# EAGLE design vga_board (EAGLE 7.7.0)
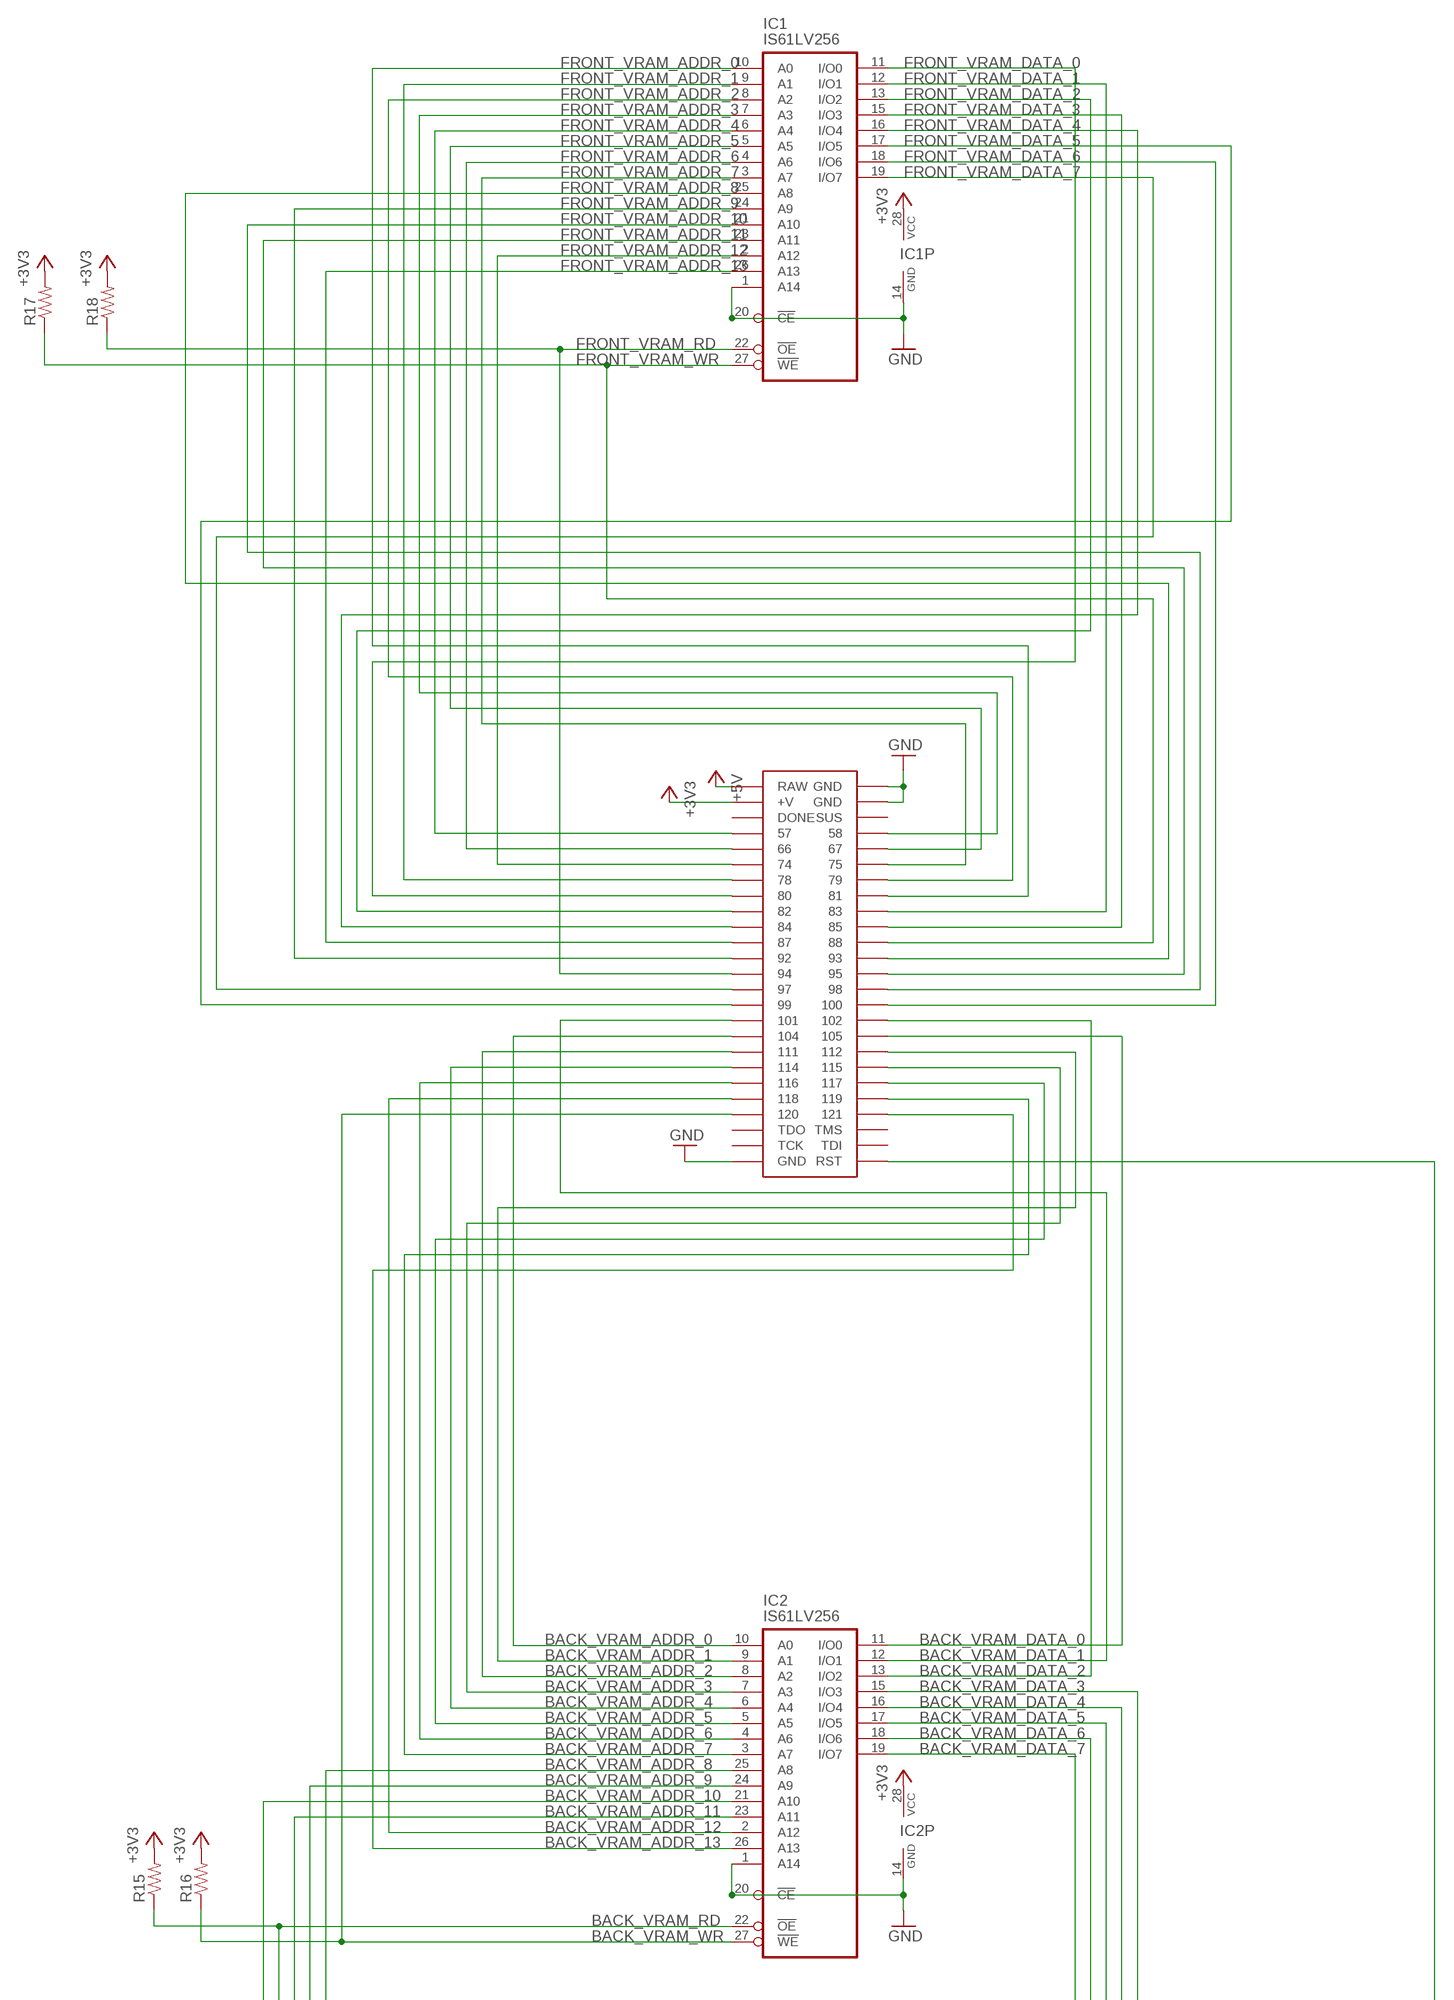
[diagram p0: schematic, sheet 1, part 1 of 2]
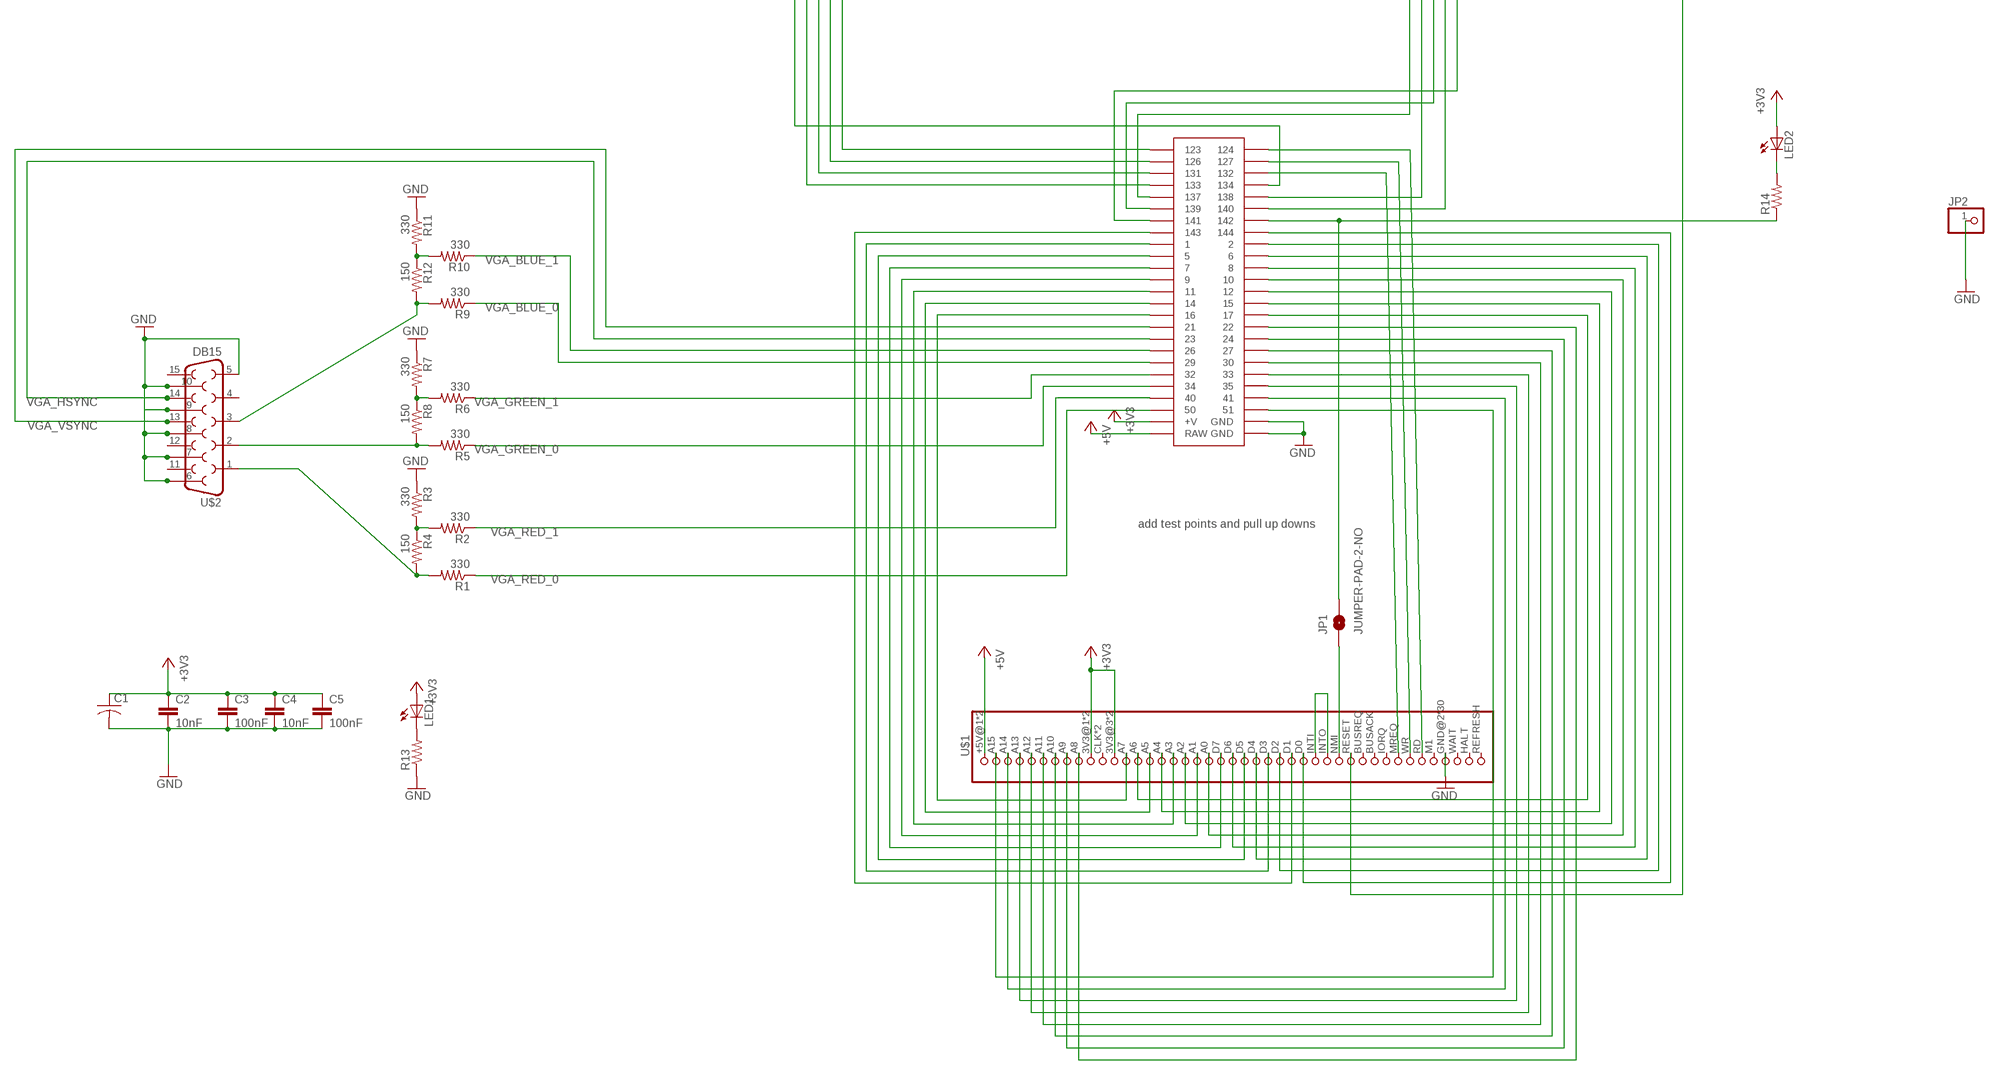
[diagram p1: schematic, sheet 1, part 2 of 2]

## Parts
C1  C-USC1210  [C1210]
C2  10nF  22UF-6.3V-20%(0805)  [0805]
C3  100nF  22UF-6.3V-20%(0805)  [0805]
C4  10nF  22UF-6.3V-20%(0805)  [0805]
C5  100nF  22UF-6.3V-20%(0805)  [0805]
IC1  IS61LV256  [SOJ28/3_LONGPAD]
IC2  IS61LV256  [SOJ28/3_LONGPAD]
JP1  JUMPER-PAD-2-NO  [PAD-JUMPER-2-NO_NO_SILK]
JP2  PINHD-1X1  [1X01]
LED1  LEDCHIP-LED0805  [CHIP-LED0805]
LED2  LEDCHIP-LED0805  [CHIP-LED0805]
R1  330  RESISTOR0805-RES  [0805]
R2  330  RESISTOR0805-RES  [0805]
R3  330  RESISTOR0805-RES  [0805]
R4  150  RESISTOR0805-RES  [0805]
R5  330  RESISTOR0805-RES  [0805]
R6  330  RESISTOR0805-RES  [0805]
R7  330  RESISTOR0805-RES  [0805]
R8  150  RESISTOR0805-RES  [0805]
R9  330  RESISTOR0805-RES  [0805]
R10  330  RESISTOR0805-RES  [0805]
R11  330  RESISTOR0805-RES  [0805]
R12  150  RESISTOR0805-RES  [0805]
R13  RESISTOR0805-RES  [0805]
R14  RESISTOR0805-RES  [0805]
R15  RESISTOR0805-RES  [0805]
R16  RESISTOR0805-RES  [0805]
R17  RESISTOR0805-RES  [0805]
R18  RESISTOR0805-RES  [0805]
U$1  FAP_BUS  [2X38]
U$2  DB15  [DB15]
U$3  MOJOV3_NO_LABEL  [MOJO_V3_NO_LABEL]

## Nets
+3V3: C1.1 C2.1 C3.1 C4.1 C5.1 IC1.28(VCC) IC2.28(VCC) LED1.A LED2.A R15.2 R16.2 R17.2 R18.2 U$1.3V3@1 U$1.3V3@2 U$1.3V3@3 U$1.3V3@4 U$3.V@1(+V)
+5V: U$1.+5V@1 U$1.+5V@2 U$3.RAW@1(RAW)
+V: U$3.V@2(+V) ; supply symbol labelled +3V3
BACK_VRAM_ADDR_0: IC2.10(A0) U$3.104
BACK_VRAM_ADDR_1: IC2.9(A1) U$3.112
BACK_VRAM_ADDR_2: IC2.8(A2) U$3.111
BACK_VRAM_ADDR_3: IC2.7(A3) U$3.115
BACK_VRAM_ADDR_4: IC2.6(A4) U$3.114
BACK_VRAM_ADDR_5: IC2.5(A5) U$3.117
BACK_VRAM_ADDR_6: IC2.4(A6) U$3.116
BACK_VRAM_ADDR_7: IC2.3(A7) U$3.119
BACK_VRAM_ADDR_8: IC2.25(A8) U$3.123
BACK_VRAM_ADDR_9: IC2.24(A9) U$3.126
BACK_VRAM_ADDR_10: IC2.21(A10) U$3.134
BACK_VRAM_ADDR_11: IC2.23(A11) U$3.131
BACK_VRAM_ADDR_12: IC2.2(A12) U$3.118
BACK_VRAM_ADDR_13: IC2.26(A13) U$3.121
BACK_VRAM_DATA_0: IC2.11(I/O0) U$3.105
BACK_VRAM_DATA_1: IC2.12(I/O1) U$3.101
BACK_VRAM_DATA_2: IC2.13(I/O2) U$3.102
BACK_VRAM_DATA_3: IC2.15(I/O3) U$3.141
BACK_VRAM_DATA_4: IC2.16(I/O4) U$3.140
BACK_VRAM_DATA_5: IC2.17(I/O5) U$3.139
BACK_VRAM_DATA_6: IC2.18(I/O6) U$3.138
BACK_VRAM_DATA_7: IC2.19(I/O7) U$3.137
BACK_VRAM_RD: IC2.22(!OE) R15.1 U$3.133
BACK_VRAM_WR: IC2.27(!WE) R16.1 U$3.120
FRONT_VRAM_ADDR_0: IC1.10(A0) U$3.81
FRONT_VRAM_ADDR_1: IC1.9(A1) U$3.78
FRONT_VRAM_ADDR_2: IC1.8(A2) U$3.79
FRONT_VRAM_ADDR_3: IC1.7(A3) U$3.58
FRONT_VRAM_ADDR_4: IC1.6(A4) U$3.57
FRONT_VRAM_ADDR_5: IC1.5(A5) U$3.67
FRONT_VRAM_ADDR_6: IC1.4(A6) U$3.66
FRONT_VRAM_ADDR_7: IC1.3(A7) U$3.75
FRONT_VRAM_ADDR_8: IC1.25(A8) U$3.93
FRONT_VRAM_ADDR_9: IC1.24(A9) U$3.92
FRONT_VRAM_ADDR_10: IC1.21(A10) U$3.98
FRONT_VRAM_ADDR_11: IC1.23(A11) U$3.95
FRONT_VRAM_ADDR_12: IC1.2(A12) U$3.74
FRONT_VRAM_ADDR_13: IC1.26(A13) U$3.87
FRONT_VRAM_DATA_0: IC1.11(I/O0) U$3.80
FRONT_VRAM_DATA_1: IC1.12(I/O1) U$3.83
FRONT_VRAM_DATA_2: IC1.13(I/O2) U$3.82
FRONT_VRAM_DATA_3: IC1.15(I/O3) U$3.85
FRONT_VRAM_DATA_4: IC1.16(I/O4) U$3.84
FRONT_VRAM_DATA_5: IC1.17(I/O5) U$3.99
FRONT_VRAM_DATA_6: IC1.18(I/O6) U$3.100
FRONT_VRAM_DATA_7: IC1.19(I/O7) U$3.97
FRONT_VRAM_RD: IC1.22(!OE) R18.1 U$3.94
FRONT_VRAM_WR: IC1.27(!WE) R17.1 U$3.88
GND: C1.2 C2.2 C3.2 C4.2 C5.2 IC1.1(A14) IC1.14(GND) IC1.20(!CE) IC2.1(A14) IC2.14(GND) IC2.20(!CE) JP2.1 R3.1 R7.1 R11.1 R13.1 U$1.GND@2(GND) U$1.GND@3(GND) U$1.GND@4(GND) U$1.GND@5(GND) U$1.GND@6(GND) U$1.GND@7(GND) U$1.GND@8(GND) U$1.GND@9(GND) U$1.GND@13(GND) U$1.GND@14(GND) U$1.GND@15(GND) U$1.GND@16(GND) U$1.GND@17(GND) U$1.GND@18(GND) U$1.GND@19(GND) U$1.GND@20(GND) U$1.GND@21(GND) U$1.GND@22(GND) U$1.GND@23(GND) U$1.GND@24(GND) U$1.GND@25(GND) U$1.GND@26(GND) U$1.GND@27(GND) U$1.GND@28(GND) U$1.GND@30(GND) U$1.GND@34(GND) U$1.GND@35(GND) U$1.GND@36(GND) U$1.GND@37(GND) U$1.GND@38(GND) U$2.5 U$2.6 U$2.7 U$2.8 U$2.9 U$2.10 U$3.GND@1(GND) U$3.GND@2(GND) U$3.GND@3(GND) U$3.GND@4(GND) U$3.GND@6(GND)
N$1: R2.2 R3.2 R4.1
N$2: R1.2 R4.2 U$2.1
N$3: R6.2 R7.2 R8.1
N$4: R5.2 R8.2 U$2.2
N$5: R10.2 R11.2 R12.1
N$6: R9.2 R12.2 U$2.3
N$7: U$1.A15 U$3.51
N$8: U$1.A14 U$3.41
N$9: U$1.A13 U$3.35
N$10: U$1.A12 U$3.33
N$11: U$1.RD U$3.124
N$12: U$1.WR U$3.127
N$13: U$1.MREQ U$3.132
N$14: U$1.A11 U$3.30
N$15: U$1.A10 U$3.27
N$16: U$1.A9 U$3.24
N$17: U$1.A8 U$3.22
N$18: U$1.A7 U$3.16
N$19: U$1.A6 U$3.17
N$20: U$1.A5 U$3.14
N$21: U$1.A4 U$3.15
N$22: U$1.A3 U$3.11
N$23: U$1.A2 U$3.12
N$24: U$1.A1 U$3.9
N$25: U$1.A0 U$3.10
N$26: U$1.D7 U$3.7
N$27: U$1.D6 U$3.8
N$28: U$1.D5 U$3.5
N$29: U$1.D4 U$3.6
N$30: U$1.D3 U$3.1
N$31: U$1.D2 U$3.2
N$32: U$1.D1 U$3.143
N$33: U$1.D0 U$3.144
N$34: LED1.C R13.2
N$35: LED2.C R14.2
N$36: JP1.2 R14.1 U$3.142
N$37: U$1.RESET U$3.RST
N$38: U$1.INTI U$1.INTO
N$39: JP1.1 U$1.NMI
RAW: U$3.RAW@2(RAW) ; supply symbol labelled +5V
VGA_BLUE_0: R9.1 U$3.29
VGA_BLUE_1: R10.1 U$3.26
VGA_GREEN_0: R5.1 U$3.34
VGA_GREEN_1: R6.1 U$3.32
VGA_HSYNC: U$2.14 U$3.23
VGA_RED_0: R1.1 U$3.50
VGA_RED_1: R2.1 U$3.40
VGA_VSYNC: U$2.13 U$3.21
Unconnected: U$1.BUSACK U$1.BUSREQ U$1.CLK U$1.CLK@2 U$1.HALT U$1.IORQ U$1.M1 U$1.REFRESH U$1.WAIT U$2.4 U$2.11 U$2.12 U$2.15 U$3.DONE U$3.SUS U$3.TCK U$3.TDI U$3.TDO U$3.TMS

## Notes on the sheet
- add test points and pull up downs

## Library data of the parts
C1 = cpu_board:C-US: CAPACITOR, American symbol
C2-C5 = cpu_board:22UF-6.3V-20%(0805): CAP-08402 Ceramic; PROD_ID: CAP-08402; VALUE: 22uF
IC1 IC2 = 61lv256:IS61LV256: RAM 32K x 8
JP1 = SparkFun-Passives:JUMPER-PAD-2-NO
JP2 = pinhead:PINHD-1X1: PIN HEADER
LED1 LED2 = cpu_board:LED: LED OSRAM: - CHIPLED LG R971, LG N971, LY N971, LG Q971, LY Q971, LO R971, LY R971 LH N974, LH R974 LS Q976, LO Q976, LY Q976 LO Q996 - Hyper CHIPLED LW Q18S LB Q993, LB Q99A, LB R99A - SideLED LS A670, LO A670, LY A670, LG A670, LP A670 LB A673, LV A673, LT A673, LW A673 LH A674 LY A675 LS A676, LA A676, LO A676, LY A676, LW A676 LS A679, LY A679, LG A679 - Hyper Micro SIDELED® LS Y876, LA Y876, LO Y876, LY Y876 LT Y87S - SmartLED LW L88C, LW L88S LB L89C, LB L89S, LG L890 LS L89K, LO L89K, LY L89K LS L896, LA L896, LO L896, LY L896 - TOPLED LS T670, LO T670, LY T670, LG T670, LP T670 LSG T670, LSP T670, LSY T670, LOP T670, LYG T670 LG T671, LOG T671, LSG T671 LB T673, LV T673, LT T673, LW T673 LH T674 LS T676, LA T676, LO T676, LY T676, LB T676, LH T676, LSB T676, LW T676 LB T67C, LV T67C, LT T67C, LS T67K, LO T67K, LY T67K, LW E67C LS E67B, LA E67B, LO E67B, LY E67B, LB E67C, LV E67C, LT E67C LW T67C LS T679, LY T679, LG T679 LS T770, LO T770, LY T770, LG T770, LP T770 LB T773, LV T773, LT T773, LW T773 LH T774 LS E675, LA E675, LY E675, LS T675 LS T776, LA T776, LO T776, LY T776, LB T776 LHGB T686 LT T68C, LB T68C - Hyper Mini TOPLED® LB M676 - Mini TOPLED Santana® LG M470 LS M47K, LO M47K, LY M47K Source: http://www.osram.convergy.de/
R1-R12 = SparkFun-Resistors:RESISTOR: Resistor Basic schematic elements and footprints for 0603, 1206, and PTH resistors.
R13-R18 = cpu_board:RESISTOR: Resistor Basic schematic elements and footprints for 0603, 1206, and PTH resistors.
U$1 = fap_bus:FAP_BUS
U$2 = SparkFun-Connectors:DB15: DB15 / VGA right angle through-hole female connector.
U$3 = Mojo_v3_MIRRORED_noheader:MOJO

## Board
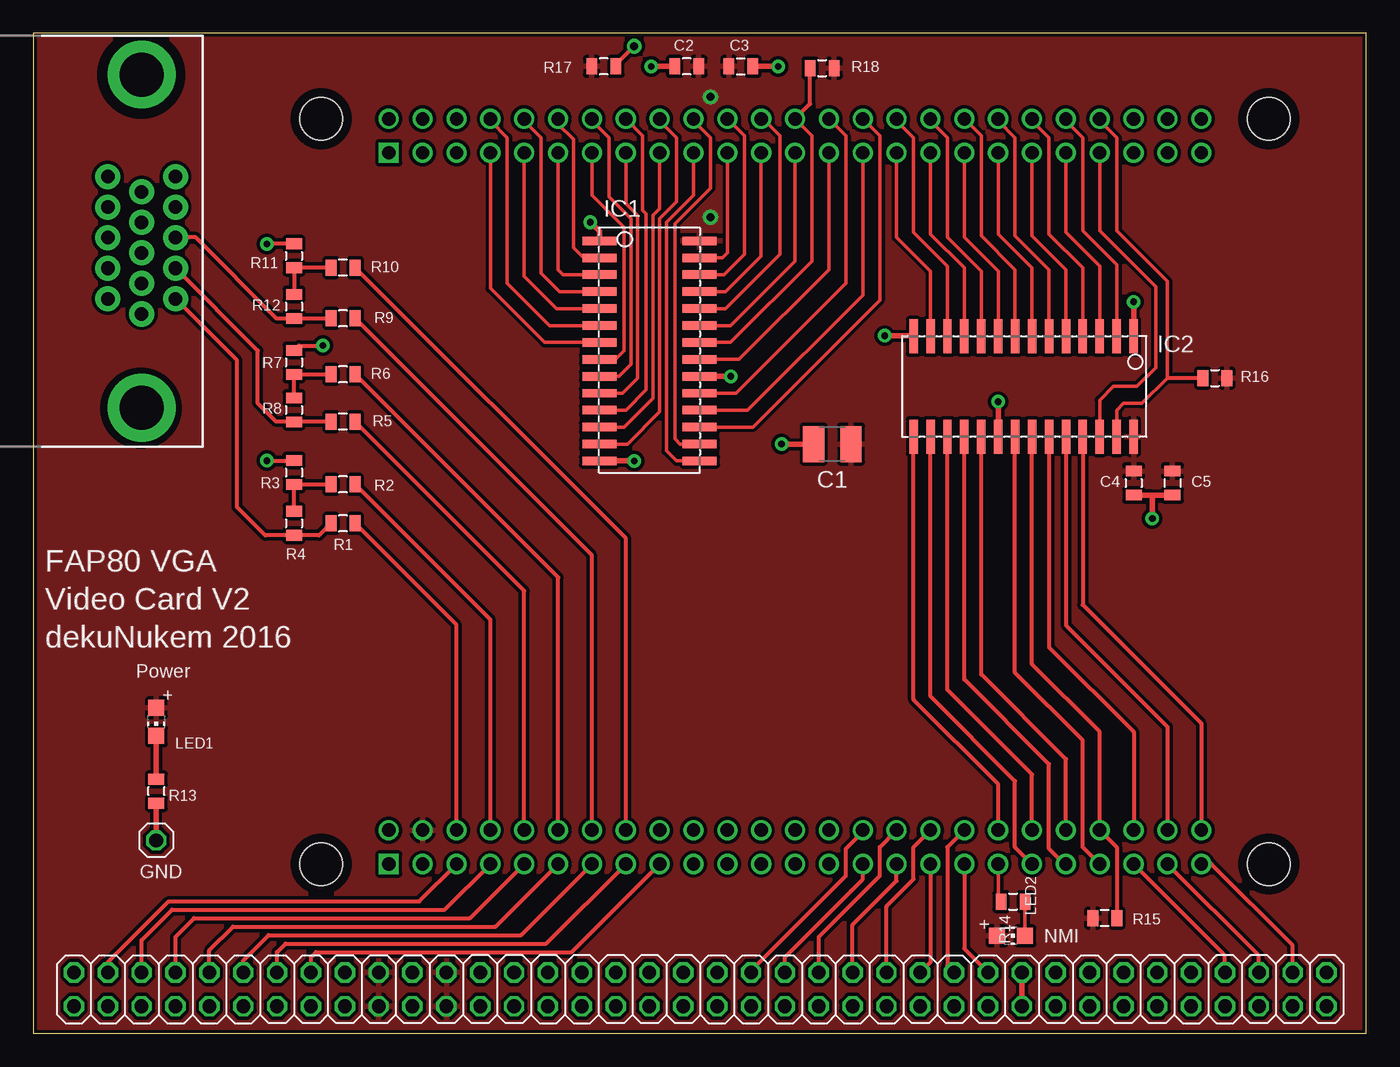
[diagram p2: board, top side]
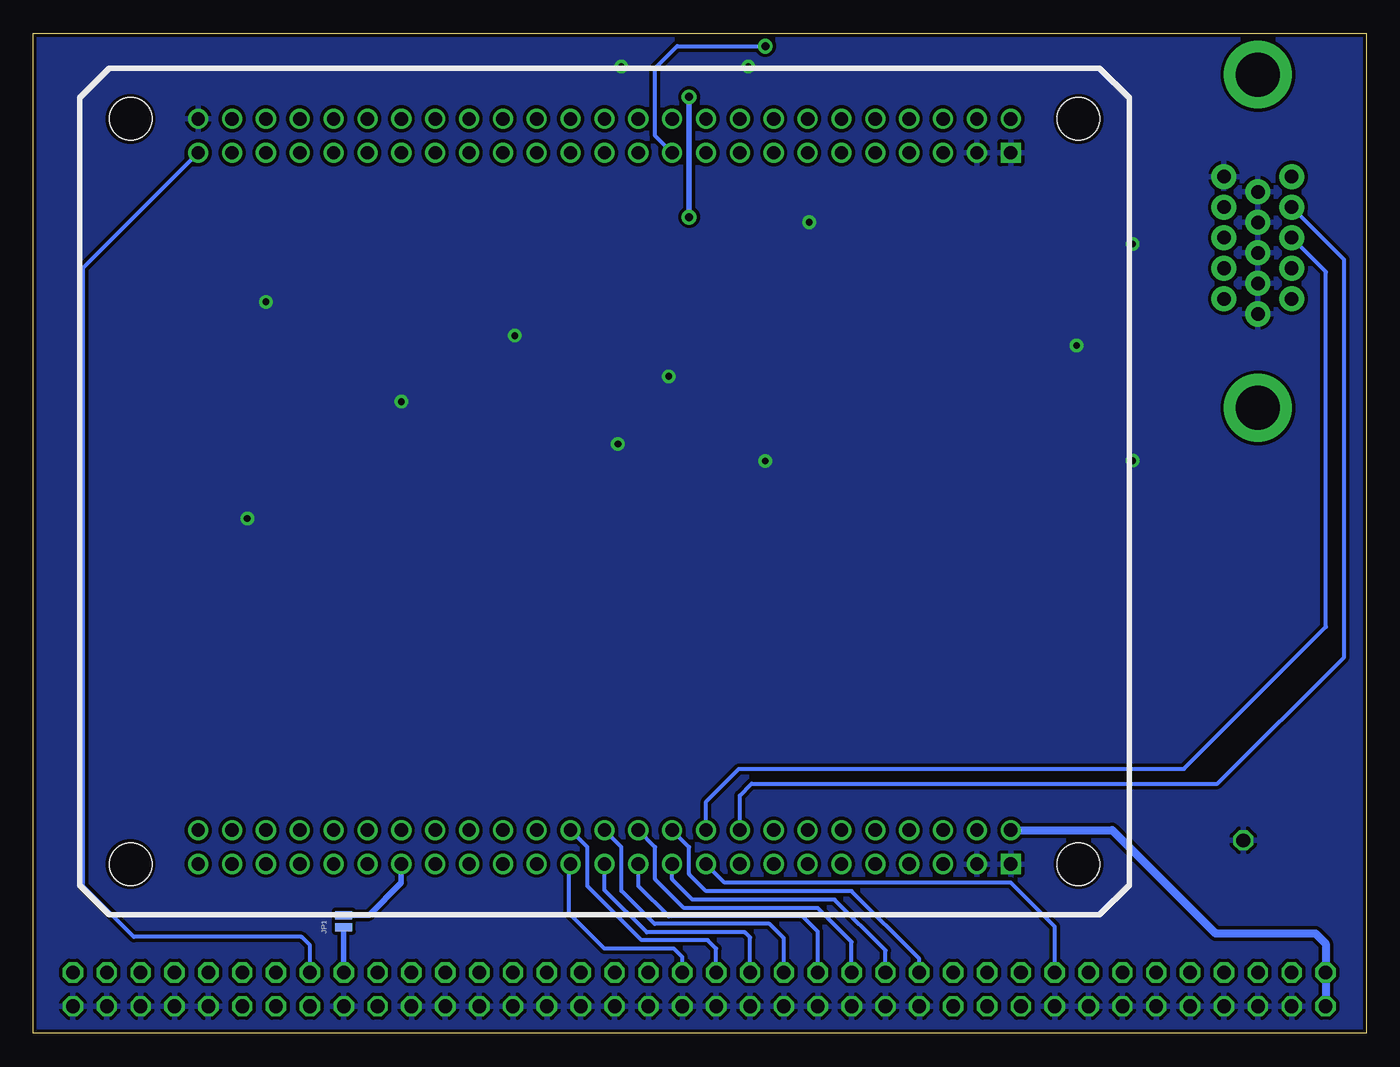
[diagram p3: board, bottom side, seen from below]

Size 100 x 75 mm. Coordinates in mm from the lower left corner, seen from the top.
Outline: 0,0 100,0 100,75 0,75 0,0
Copper layers (1*16): Top 0.035mm / dielectric 1.5mm / Bottom 0.035mm
Design rules "SparkFun-2-layer-STANDARD": minimum track width 10mil, minimum drill 20mil, track to track 10mil, track to pad 8mil, pad to pad 8mil, via to via 10mil, smd to smd 8mil, copper to edge 8mil, drill to drill 8mil, minimum pad ring 10mil, minimum via ring 10mil, stop-mask expansion 4mil, vias tented up to drill 25mil, thermal gap 10mil
tRestrict: area 90.7,10.7 to 94.7,14.7; area 19.6,10.7 to 23.6,14.7; area 19.6,66.5 to 23.6,70.6; area 90.7,66.5 to 94.7,70.6; area 5.3,44.1 to 10.9,49.7; area 5,68.8 to 11.1,74.9

### Footprints (pad centres in the part's own frame; a part is rotated, then mirrored left to right if it is on the bottom)
C1210 = smd 1.6 x 2.7: 1 -1.4,0; 2 1.4,0
0805 = smd 0.8 x 1.2: 1 -0.9,0; 2 0.9,0
SOJ28/3_LONGPAD = smd 0.635 x 2.54: 1 -7.62,-3.759; 2 -6.35,-3.759; 3 -5.08,-3.759; 4 -3.81,-3.759; 5 -2.54,-3.759; 6 -1.27,-3.759; 7 0,-3.759; 8 1.27,-3.759; 9 2.54,-3.759; 10 3.81,-3.759; 11 5.08,-3.759; 12 6.35,-3.759; 13 7.62,-3.759; 14 8.89,-3.759; 15 8.89,3.759; 16 7.62,3.759; 17 6.35,3.759; 18 5.08,3.759; 19 3.81,3.759; 20 2.54,3.759; 21 1.27,3.759; 22 0,3.759; 23 -1.27,3.759; 24 -2.54,3.759; 25 -3.81,3.759; 26 -5.08,3.759; 27 -6.35,3.759; 28 -7.62,3.759
PAD-JUMPER-2-NO_NO_SILK = smd 0.635 x 1.27: 1 -0.45,0; 2 0.45,0
1X01 = drill 1.016 octagon: 1 0,0
CHIP-LED0805 = smd 1.2 x 1.2: A 0,-1.05; C 0,1.05
2X38 = drill 1.016 octagon: 3V3@1 -6.35,0; 3V3@2 -6.35,2.54; 3V3@3 -1.27,0; 3V3@4 -1.27,2.54; +5V@1 -29.21,2.54; +5V@2 -29.21,0; A0 19.05,2.54; A1 16.51,2.54; A2 13.97,2.54; A3 11.43,2.54; A4 8.89,2.54; A5 6.35,2.54; A6 3.81,2.54; A7 1.27,2.54; A8 -8.89,2.54; A9 -11.43,2.54; A10 -13.97,2.54; A11 -16.51,2.54; A12 -19.05,2.54; A13 -21.59,2.54; A14 -24.13,2.54; A15 -26.67,2.54; BUSACK 52.07,2.54; BUSREQ 49.53,2.54; CLK -3.81,2.54; CLK@2 -3.81,0; D0 39.37,2.54; D1 36.83,2.54; D2 34.29,2.54; D3 31.75,2.54; D4 29.21,2.54; D5 26.67,2.54; D6 24.13,2.54; D7 21.59,2.54; GND@2 -26.67,0; GND@3 -24.13,0; GND@4 -21.59,0; GND@5 -19.05,0; GND@6 -16.51,0; GND@7 -13.97,0; GND@8 -11.43,0; GND@9 -8.89,0; GND@13 1.27,0; GND@14 3.81,0; GND@15 6.35,0; GND@16 8.89,0; GND@17 11.43,0; GND@18 13.97,0; GND@19 16.51,0; GND@20 19.05,0; GND@21 21.59,0; GND@22 24.13,0; GND@23 26.67,0; GND@24 29.21,0; GND@25 31.75,0; GND@26 34.29,0; GND@27 36.83,0; GND@28 39.37,0; GND@30 44.45,0; GND@34 54.61,0; GND@35 57.15,0; GND@36 59.69,0; GND@37 62.23,0; GND@38 64.77,0; HALT 52.07,0; INTI 41.91,0; INTO 41.91,2.54; IORQ 54.61,2.54; M1 64.77,2.54; MREQ 57.15,2.54; NMI 44.45,2.54; RD 62.23,2.54; REFRESH 46.99,0; RESET 46.99,2.54; WAIT 49.53,0; WR 59.69,2.54
DB15 = drill 1.016 pad 1.88: 1 -4.32,-7.62; 2 -2.03,-7.62; 3 0.26,-7.62; 4 2.55,-7.62; 5 4.84,-7.62; 6 -5.46,-5.08; 7 -3.17,-5.08; 8 -0.88,-5.08; 9 1.41,-5.08; 10 3.7,-5.08; 11 -4.32,-2.54; 12 -2.03,-2.54; 13 0.26,-2.54; 14 2.55,-2.54; 15 4.84,-2.54 | drill 3.302 pad 5.08: G1 -12.5,-5.08; G2 12.5,-5.08
MOJO_V3_NO_LABEL = drill 1: 1 29.21,57.15; 2 29.21,59.69; 5 31.75,57.15; 6 31.75,59.69; 7 34.29,57.15; 8 34.29,59.69; 9 36.83,57.15; 10 36.83,59.69; 11 39.37,57.15; 12 39.37,59.69; 14 41.91,57.15; 15 41.91,59.69; 16 44.45,57.15; 17 44.45,59.69; 21 46.99,57.15; 22 46.99,59.69; 23 49.53,57.15; 24 49.53,59.69; 26 52.07,57.15; 27 52.07,59.69; 29 54.61,57.15; 30 54.61,59.69; 32 57.15,57.15; 33 57.15,59.69; 34 59.69,57.15; 35 59.69,59.69; 40 62.23,57.15; 41 62.23,59.69; 50 64.77,57.15; 51 64.77,59.69; 57 62.23,3.81; 58 62.23,6.35; 66 59.69,3.81; 67 59.69,6.35; 74 57.15,3.81; 75 57.15,6.35; 78 54.61,3.81; 79 54.61,6.35; 80 52.07,3.81; 81 52.07,6.35; 82 49.53,3.81; 83 49.53,6.35; 84 46.99,3.81; 85 46.99,6.35; 87 44.45,3.81; 88 44.45,6.35; 92 41.91,3.81; 93 41.91,6.35; 94 39.37,3.81; 95 39.37,6.35; 97 36.83,3.81; 98 36.83,6.35; 99 34.29,3.81; 100 34.29,6.35; 101 31.75,3.81; 102 31.75,6.35; 104 29.21,3.81; 105 29.21,6.35; 111 26.67,3.81; 112 26.67,6.35; 114 24.13,3.81; 115 24.13,6.35; 116 21.59,3.81; 117 21.59,6.35; 118 19.05,3.81; 119 19.05,6.35; 120 16.51,3.81; 121 16.51,6.35; 123 8.89,57.15; 124 8.89,59.69; 126 11.43,57.15; 127 11.43,59.69; 131 13.97,57.15; 132 13.97,59.69; 133 16.51,57.15; 134 16.51,59.69; 137 19.05,57.15; 138 19.05,59.69; 139 21.59,57.15; 140 21.59,59.69; 141 24.13,57.15; 142 24.13,59.69; 143 26.67,57.15; 144 26.67,59.69; DONE 64.77,3.81; GND@2 67.31,59.69; GND@4 67.31,6.35; GND@6 8.89,3.81; RAW@1 69.85,57.15; RAW@2 69.85,3.81; RST 8.89,6.35; SUS 64.77,6.35; TCK 11.43,3.81; TDI 11.43,6.35; TDO 13.97,3.81; TMS 13.97,6.35; V@1 67.31,57.15; V@2 67.31,3.81 | drill 1 square: GND@1 69.85,59.69; GND@3 69.85,6.35 | hole 3.2: 74.93,3.81; 74.93,59.69; 3.81,59.69; 3.81,3.81

### Placement (x,y rotation side)
C1  59.94,44.2 180 top
C2  49.02,72.52 180 top
C3  53.09,72.52 0 top
C4  82.55,41.27 270 top
C5  85.47,41.27 270 top
IC1  46.23,51.82 270 top
IC2  74.93,48.51 180 top
JP1  76.71,8.41 90 bottom
JP2  9.22,14.48 0 top
LED1  9.22,23.37 180 top
LED2  73.36,7.32 270 top
R1  23.24,38.25 180 top
R2  23.24,41.17 180 top
R3  19.56,42.06 270 top
R4  19.56,38.25 270 top
R5  23.24,45.87 180 top
R6  23.24,49.43 180 top
R7  19.56,50.32 270 top
R8  19.56,46.76 270 top
R9  23.24,53.62 180 top
R10  23.24,57.43 180 top
R11  19.56,58.32 270 top
R12  19.56,54.51 270 top
R13  9.22,18.16 90 top
R14  73.51,9.88 0 top
R15  80.39,8.64 180 top
R16  88.65,49.15 0 top
R17  42.8,72.52 180 top
R18  59.18,72.39 0 top
U$1  32.26,2.03 0 top
U$2  3.05,59.41 90 top
U$3  96.52,72.39 180 top

### Tracks (layer width: path | path; a pad name or v marks a point on that pad's centre or on a via)
+3V3  (via drill 0.6)
  Bottom 0.406: v50.8,70.23 v50.8,61.21
  pour Top (isolate 0.254): 0,75 100.33,75 100.33,0 0,0
+5V
  Bottom 0.61: U$3.RAW@1 19.05,15.24 11.3,7.49 3.81,7.49 3.05,6.73 U$1.+5V@1 U$1.+5V@2
BACK_VRAM_ADDR_0
  Top 0.254: U$3.104 67.31,68.45 68.58,67.18 68.58,59.69 71.12,57.15 IC2.10
BACK_VRAM_ADDR_1
  Top 0.254: U$3.112 69.85,59.69 72.39,57.15 IC2.9
BACK_VRAM_ADDR_2
  Top 0.254: U$3.111 71.12,67.31 71.12,59.82 73.66,57.28 IC2.8
BACK_VRAM_ADDR_3
  Top 0.254: U$3.115 72.39,59.94 74.93,57.4 IC2.7
BACK_VRAM_ADDR_4
  Top 0.254: U$3.114 72.39,68.45 73.66,67.18 73.66,59.82 76.2,57.28 IC2.6
BACK_VRAM_ADDR_5
  Top 0.254: U$3.117 74.93,59.82 77.47,57.28 IC2.5
BACK_VRAM_ADDR_6
  Top 0.254: U$3.116 74.93,68.45 76.2,67.18 76.2,59.94 78.74,57.4 IC2.4
BACK_VRAM_ADDR_7
  Top 0.254: U$3.119 77.47,60.07 80.01,57.53 IC2.3
BACK_VRAM_ADDR_8
  Top 0.305: IC2.25 78.74,32.13 87.63,23.24 U$3.123
BACK_VRAM_ADDR_9
  Top 0.305: IC2.24 77.47,30.61 85.09,22.99 U$3.126
BACK_VRAM_ADDR_10
  Top 0.305: U$3.134 78.74,13.97 78.74,21.97 73.66,27.05 IC2.21
BACK_VRAM_ADDR_11
  Top 0.305: IC2.23 76.2,28.96 82.55,22.61 U$3.131
BACK_VRAM_ADDR_12
  Top 0.254: U$3.118 77.47,68.45 78.74,67.18 78.74,60.2 81.28,57.66 IC2.2
BACK_VRAM_ADDR_13
  Top 0.254: U$3.121 80.01,60.2 84.2,56.01 84.2,49.91 82.8,48.51 81.03,48.51 80.01,47.5 IC2.26
BACK_VRAM_DATA_0
  Top 0.254: U$3.105 67.31,59.94 69.85,57.4 IC2.11
BACK_VRAM_DATA_1
  Top 0.254: U$3.101 64.77,68.45 66.04,67.18 66.04,60.07 68.58,57.53 IC2.12
BACK_VRAM_DATA_2
  Top 0.254: U$3.102 64.77,59.69 67.31,57.15 IC2.13
BACK_VRAM_DATA_3
  Top 0.305: U$3.141 72.39,18.67 66.04,25.02 IC2.15
BACK_VRAM_DATA_4
  Top 0.305: U$3.140 73.66,13.97 73.66,18.92 67.31,25.27 IC2.16
BACK_VRAM_DATA_5
  Top 0.305: U$3.139 74.93,19.43 68.58,25.78 IC2.17
BACK_VRAM_DATA_6
  Top 0.305: U$3.138 77.34,12.7 76.2,13.84 76.2,20.19 69.85,26.54 IC2.18
BACK_VRAM_DATA_7
  Top 0.305: U$3.137 77.47,20.57 71.12,26.92 IC2.19
BACK_VRAM_RD
  Top 0.305: IC2.22 74.93,27.69 80.01,22.61 U$3.133 81.29,13.96 R15.1
BACK_VRAM_WR
  Top 0.254: U$3.120 80.01,68.45 81.28,67.18 81.28,60.2 85.09,56.39 85.09,49.15 83.19,47.24 81.79,47.24 81.28,46.74 IC2.27
  Top 0.305: R16.1 85.09,49.15
FRONT_VRAM_ADDR_0
  Top 0.254: U$3.81 44.45,62.23 45.34,61.34 45.34,49.15 44.2,48.01 IC1.10
FRONT_VRAM_ADDR_1
  Top 0.254: U$3.78 41.91,68.45 43.18,67.18 43.18,62.74 44.83,61.09 44.83,50.16 43.94,49.28 IC1.9
FRONT_VRAM_ADDR_2
  Top 0.254: U$3.79 41.91,62.87 44.32,60.45 44.32,51.18 43.69,50.55 IC1.8
FRONT_VRAM_ADDR_3
  Top 0.254: IC1.7 38.35,51.82 34.29,55.88 U$3.58
FRONT_VRAM_ADDR_4
  Top 0.254: U$3.57 34.29,68.45 35.56,67.18 35.56,56.26 38.73,53.09 IC1.6
FRONT_VRAM_ADDR_5
  Top 0.254: IC1.5 39.24,54.36 36.83,56.77 U$3.67
FRONT_VRAM_ADDR_6
  Top 0.254: U$3.66 36.83,68.45 38.1,67.18 38.1,57.02 39.5,55.63 IC1.4
FRONT_VRAM_ADDR_7
  Top 0.254: IC1.3 39.75,56.9 39.37,57.28 U$3.75
FRONT_VRAM_ADDR_8
  Top 0.254: U$3.93 54.61,58.29 51.94,55.63 IC1.25
FRONT_VRAM_ADDR_9
  Top 0.254: U$3.92 54.74,68.58 56.01,67.31 56.01,58.42 51.94,54.36 IC1.24
FRONT_VRAM_ADDR_10
  Top 0.254: U$3.98 59.69,57.28 52.96,50.55 IC1.21
FRONT_VRAM_ADDR_11
  Top 0.254: U$3.95 57.15,57.91 52.32,53.09 IC1.23
FRONT_VRAM_ADDR_12
  Top 0.254: U$3.74 39.37,68.2 40.51,67.06 40.51,58.93 41.27,58.17 IC1.2
FRONT_VRAM_ADDR_13
  Top 0.254: U$3.87 53.34,67.31 53.34,58.42 51.82,56.9 IC1.26
FRONT_VRAM_DATA_0
  Top 0.254: U$3.80 45.72,67.31 45.72,61.72 45.97,61.47 45.97,48.26 44.45,46.74 IC1.11
FRONT_VRAM_DATA_1
  Top 0.254: U$3.83 46.99,61.85 46.48,61.34 46.48,47.62 44.32,45.47 IC1.12
FRONT_VRAM_DATA_2
  Top 0.254: U$3.82 46.99,68.45 48.26,67.18 48.26,62.36 46.99,61.09 46.99,46.61 44.58,44.2 IC1.13
FRONT_VRAM_DATA_3
  Top 0.254: U$3.85 49.53,62.87 47.5,60.83 47.5,43.69 48.26,42.93 IC1.15
FRONT_VRAM_DATA_4
  Top 0.254: U$3.84 49.53,68.45 50.8,67.18 50.8,63.37 48.13,60.71 48.13,44.58 48.51,44.2 IC1.16
FRONT_VRAM_DATA_5
  Top 0.254: U$3.99 63.5,67.31 63.5,54.99 53.98,45.47 IC1.17
FRONT_VRAM_DATA_6
  Top 0.254: U$3.100 62.23,55.37 53.59,46.74 IC1.18
FRONT_VRAM_DATA_7
  Top 0.254: U$3.97 60.96,67.31 60.96,56.26 52.7,48.01 IC1.19
FRONT_VRAM_RD
  Top 0.254: U$3.94 58.42,67.31 58.42,57.91 52.32,51.82 IC1.22
  Top 0.305: U$3.94 58.28,69.71 R18.1
FRONT_VRAM_WR  (via drill 0.6)
  Top 0.254: U$3.88 52.07,58.55 51.69,58.17 IC1.27
  Top 0.305: v45.09,74.04 43.7,72.66 R17.1
  Bottom 0.305: U$3.88 53.34,67.31 53.34,72.39 51.69,74.04 v45.09,74.04
GND  (via drill 0.51)
  Top 0.305: v17.53,42.95 17.54,42.96 R3.1 | R7.1 19.93,51.59 v21.72,51.59 | R11.1 19.55,59.21 v17.53,59.21 | 65.99,52.32 IC2.14
  Top 0.406: v52.32,49.28 IC1.20 | v41.78,60.83 42.47,60.15 IC1.1 | IC1.14 v45.09,42.93 | v46.35,72.52 C2.2 | C3.2 v55.88,72.52 | v56.13,44.2 C1.2 | v63.88,52.32 65.99,52.32 | v72.39,47.37 IC2.20 | C4.2 83.82,40.38 | 83.82,40.38 C5.2 | IC2.1 v82.55,54.86 | v83.95,38.61 83.95,40.25 83.82,40.38 | JP2.1 R13.1
  pour Bottom (isolate 0.254): 0,75 100.33,75 100.33,0 0,0
N$1
  Top 0.305: R4.1 R3.2 19.57,41.17 R2.2
N$2
  Top 0.305: R1.2 21.44,37.35 R4.2 17.41,37.35 15.29,39.47 15.29,50.47 U$2.1
N$3
  Top 0.305: R8.1 R7.2 R6.2
N$4
  Top 0.305: R5.2 19.57,45.87 | 19.57,45.87 R8.2 | 19.57,45.87 18.21,45.87 16.84,47.24 16.84,51.21 U$2.2
N$5
  Top 0.305: R10.2 22.33,57.42 R11.2 R12.1
N$6
  Top 0.305: R9.2 22.33,53.61 R12.2 18.27,53.61 12.19,59.69 10.69,59.69 U$2.3
N$7
  Top 0.305: U$1.A15 5.59,5.33 10.16,9.91 28.96,9.91 U$3.51
N$8
  Top 0.305: U$1.A14 8.13,6.99 10.41,9.27 30.86,9.27 U$3.41
N$9
  Top 0.305: U$1.A13 10.67,7.24 12.06,8.64 32.77,8.64 U$3.35
N$10
  Top 0.305: U$1.A12 13.21,6.22 14.99,8 34.67,8 U$3.33
N$11
  Top 0.305: U$1.RD 94.49,6.6 88.39,12.7 U$3.124
N$12
  Top 0.305: U$1.WR 91.95,5.84 U$3.127
N$13
  Top 0.305: U$1.MREQ 89.41,5.84 U$3.132
N$14
  Top 0.305: U$1.A11 15.75,5.46 17.65,7.37 36.58,7.37 U$3.30
N$15
  Top 0.305: U$1.A10 18.29,6.1 18.92,6.73 38.48,6.73 U$3.27
N$16
  Top 0.305: U$1.A9 20.83,5.71 21.21,6.1 40.39,6.1 U$3.24
N$17
  Bottom 0.305: U$1.A8 23.37,8 26.67,11.3 48.13,11.3 U$3.22
N$18
  Bottom 0.305: U$1.A7 33.53,5.59 38.61,10.67 49.53,10.67 50.8,11.94 50.8,13.97 U$3.16
N$19
  Bottom 0.305: U$1.A6 36.07,6.22 39.88,10.03 50.55,10.03 52.07,11.56 U$3.17
N$20
  Bottom 0.305: U$1.A5 38.61,6.86 41.15,9.4 51.18,9.4 53.34,11.56 53.34,13.97 U$3.14
N$21
  Bottom 0.305: U$1.A4 41.15,7.62 42.29,8.76 52.32,8.76 54.61,11.05 U$3.15
N$22
  Bottom 0.305: U$3.11 55.88,13.97 55.88,10.69 53.39,8.2 44.76,8.2 43.69,7.14 U$1.A3
N$23
  Bottom 0.305: U$1.A2 46.23,7.19 46.61,7.57 53.98,7.57 57.15,10.74 U$3.12
N$24
  Bottom 0.305: U$1.A1 48.77,6.35 49.4,6.99 54.36,6.99 58.42,11.05 58.42,13.97 U$3.9
N$25
  Bottom 0.305: U$1.A0 51.31,5.71 51.94,6.35 57.15,6.35 59.82,9.02 59.82,12.57 U$3.10
N$26
  Top 0.305: U$3.7 62.23,15.11 60.96,13.84 60.96,11.81 53.85,4.7 U$1.D7
N$27
  Top 0.305: U$3.8 62.23,11.56 61.72,11.05 61.34,10.67 56.39,5.71 U$1.D6
N$28
  Top 0.305: U$3.5 63.5,13.97 63.5,11.81 58.93,7.24 U$1.D5
N$29
  Top 0.305: U$1.D4 61.47,8.13 64.77,11.43 U$3.6
N$30
  Top 0.305: U$1.D3 64.01,9.53 66.04,11.56 66.04,13.97 U$3.1
N$31
  Top 0.305: U$3.2 67.31,5.33 U$1.D2
N$32
  Top 0.305: U$3.143 68.58,13.97 68.58,5.08 U$1.D1
N$33
  Top 0.305: U$3.144 69.85,6.35 U$1.D0
N$34
  Top 0.406: LED1.C R13.2
N$35
  Top 0.254: R14.2 LED2.C
N$36
  Top 0.254: U$3.142 72.39,10.1 R14.1
  Bottom 0.406: JP1.2 74.81,8.86 72.39,11.28 U$3.142
N$37
  Bottom 0.305: U$1.RESET 79.25,6.6 79.88,7.24 92.46,7.24 96.27,11.05 96.27,57.4 U$3.RST
N$38
  Top 0.406: U$1.INTO U$1.INTI
N$39
  Bottom 0.406: U$1.NMI JP1.1
VGA_BLUE_0
  Top 0.305: U$3.29 41.91,35.85 R9.1
VGA_BLUE_1
  Top 0.305: U$3.26 44.45,37.12 R10.1
VGA_GREEN_0
  Top 0.305: U$3.34 36.83,33.18 R5.1
VGA_GREEN_1
  Top 0.305: U$3.32 39.37,34.2 R6.1
VGA_HSYNC
  Bottom 0.305: U$3.23 46.99,17.83 46.1,18.72 11.15,18.72 1.65,28.22 1.65,58.02 U$2.14
VGA_RED_0
  Top 0.305: U$3.50 31.75,30.64 R1.1
VGA_RED_1
  Top 0.305: U$3.40 34.29,31.02 R2.1
VGA_VSYNC
  Bottom 0.305: U$3.21 49.53,17.37 47.07,19.84 13.66,19.84 3.02,30.48 3.02,57.1 U$2.13

### Text on the board
tNames: FAP80 VGA / Video Card V2 / dekuNukem 2016 | Power | GND | NMI